# EAGLE design ESP-Easy FHEM Multi (EAGLE 8.4.3)
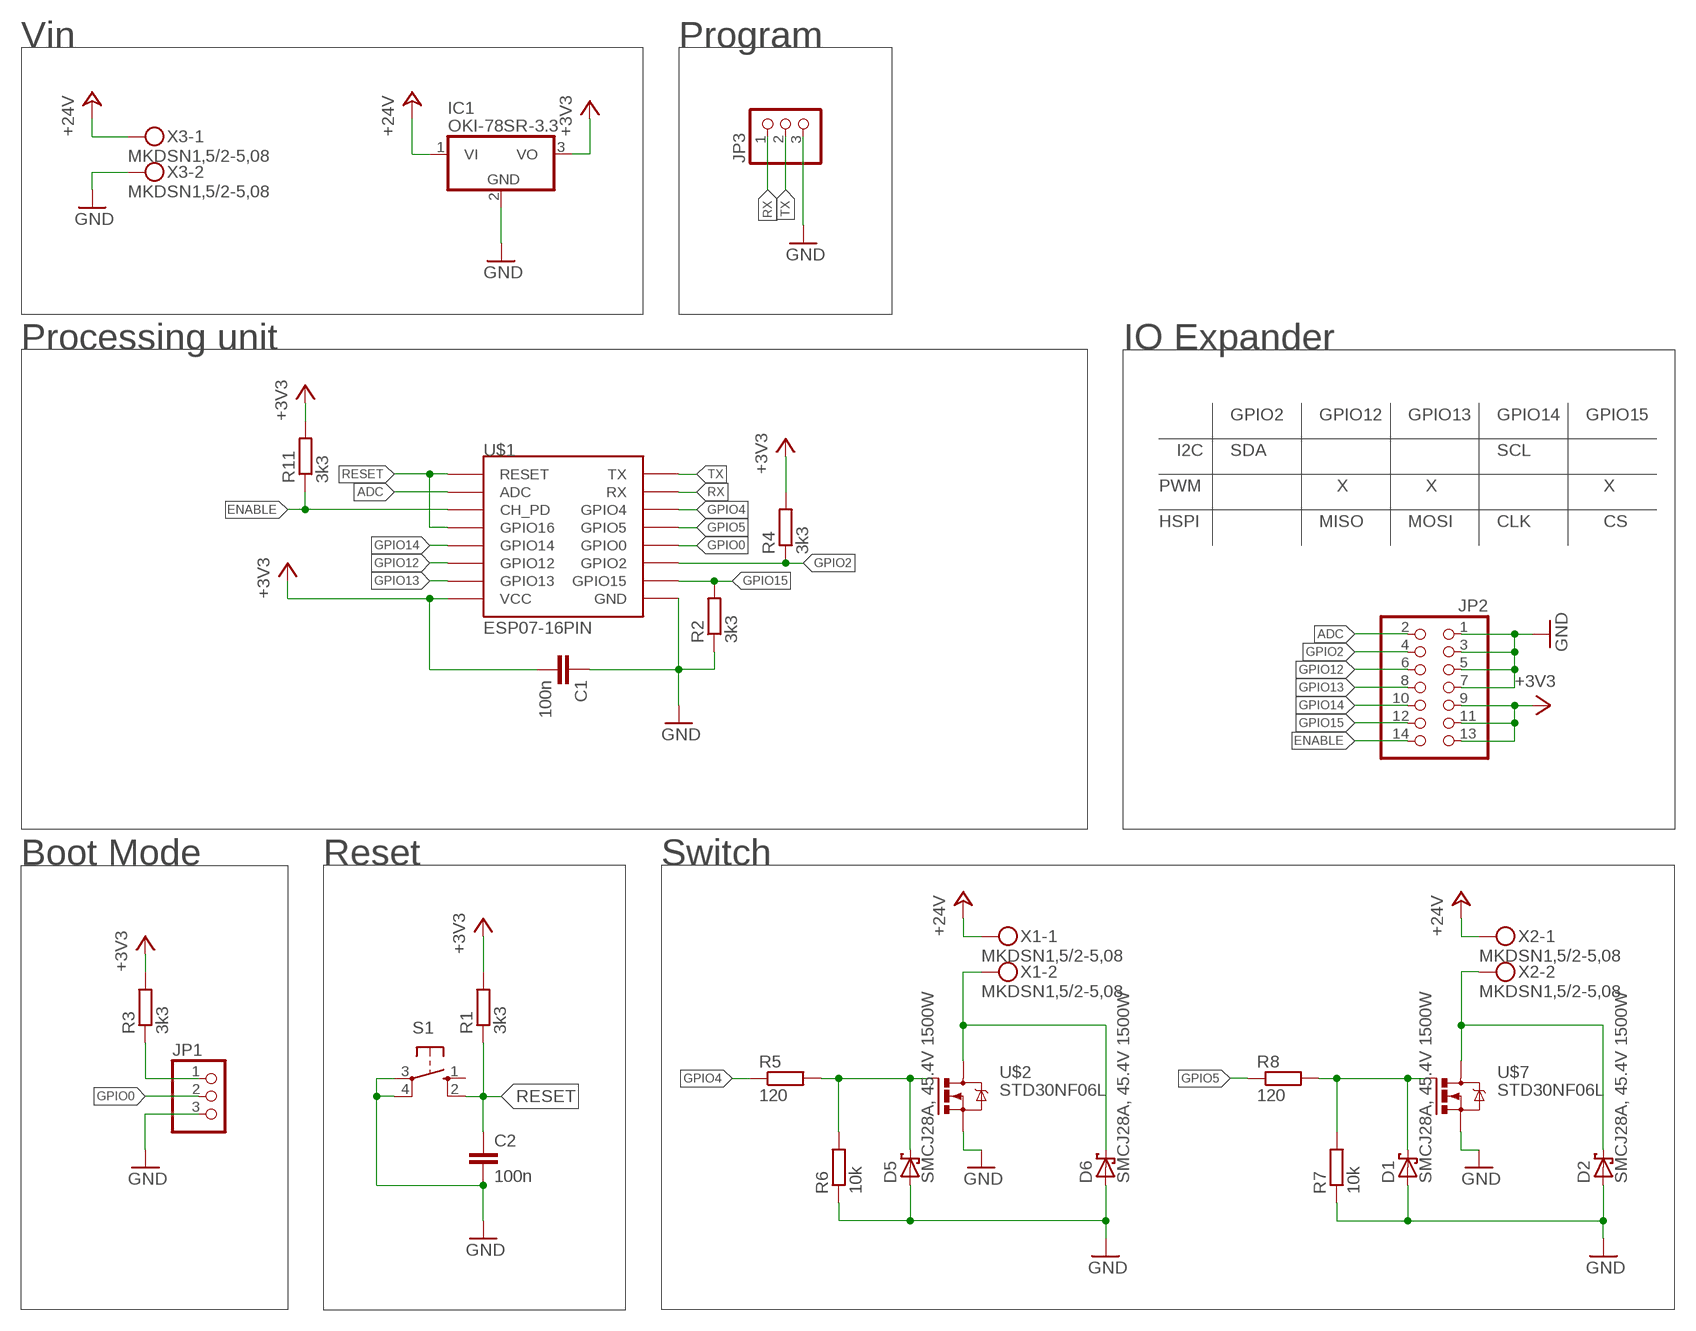
[diagram p0: schematic, sheet 1]

## Parts
C1  100n  C-EUC0603  [C0603]
C2  100n  C-EUC0603  [C0603]
D1  SMCJ28A, 45.4V 1500W  SCHOTTKY-DIODESMC  [SMC]
D2  SMCJ28A, 45.4V 1500W  SCHOTTKY-DIODESMC  [SMC]
D5  SMCJ28A, 45.4V 1500W  SCHOTTKY-DIODESMC  [SMC]
D6  SMCJ28A, 45.4V 1500W  SCHOTTKY-DIODESMC  [SMC]
IC1  OKI-78SR-3.3  7805TV  [TO220V]
JP1  PINHD-1X3  [1X03]
JP2  PINHD-2X7  [2X07]
JP3  PINHD-1X3  [1X03]
R1  3k3  R-EU_R0603  [R0603]
R2  3k3  R-EU_R0603  [R0603]
R3  3k3  R-EU_R0603  [R0603]
R4  3k3  R-EU_R0603  [R0603]
R5  120  R-EU_R0603  [R0603]
R6  10k  R-EU_R0603  [R0603]
R7  10k  R-EU_R0603  [R0603]
R8  120  R-EU_R0603  [R0603]
R11  3k3  R-EU_R0603  [R0603]
S1  10-XX  [B3F-10XX]
U$1  ESP07-16PIN  [ESP07-16PIN]
U$2  STD30NF06L  [D-PAK_TO252AA]
U$7  STD30NF06L  [D-PAK_TO252AA]
X1  MKDSN1,5/2-5,08  [MKDSN1,5/2-5,08]
X2  MKDSN1,5/2-5,08  [MKDSN1,5/2-5,08]
X3  MKDSN1,5/2-5,08  [MKDSN1,5/2-5,08]

## Nets
+3V3: C1.2 IC1.3(VO) JP2.9 JP2.11 JP2.13 R1.2 R3.2 R4.2 R11.2 U$1.VCC
+24V: IC1.1(VI) X1.1 X2.1 X3.1
ADC: JP2.2 U$1.ADC
ENABLE: JP2.14 R11.1 U$1.CH_PD
GND: C1.1 C2.2 D1.A D2.A D5.A D6.A IC1.2(GND) JP1.3 JP2.1 JP2.3 JP2.5 JP2.7 JP3.3 R2.1 R6.1 R7.1 S1.3(P) S1.4(P1) U$1.GND U$2.3(S) U$7.3(S) X3.2
GPIO0: JP1.2 U$1.GPIO0
GPIO2: JP2.4 R4.1 U$1.GPIO2
GPIO4: R5.1 U$1.GPIO4
GPIO5: R8.1 U$1.GPIO5
GPIO12: JP2.6 U$1.GPIO12
GPIO13: JP2.8 U$1.GPIO13
GPIO14: JP2.10 U$1.GPIO14
GPIO15: JP2.12 R2.2 U$1.GPIO15
N$1: D2.C U$7.4(D) X2.2
N$2: D1.C R7.2 R8.2 U$7.1(G)
N$3: D6.C U$2.4(D) X1.2
N$8: D5.C R5.2 R6.2 U$2.1(G)
N$13: JP1.1 R3.1
RESET: C2.1 R1.1 S1.2(S1) U$1.GPIO16 U$1.REST(RESET)
RX: JP3.1 U$1.RX
TX: JP3.2 U$1.TX
Unconnected: S1.1(S)

## Notes on the sheet
- Vin | Program
- Processing unit | IO Expander
- GPIO2 | GPIO12 | GPIO13 | GPIO14 | GPIO15
- I2C | SDA | SCL
- PWM | X | X | X
- HSPI | MISO | MOSI | CLK | CS
- Boot Mode | Reset | Switch

## Library data of the parts
C1 C2 = rcl:C-EU: CAPACITOR, European symbol
D1 D2 D5 D6 = diode:SCHOTTKY-DIODE: Schottky Diode
IC1 = linear:78*: Positive VOLTAGE REGULATOR Source: http://cache.national.com/ds/LM/LM78L05.pdf http://www.fairchildsemi.com/ds/LM/LM7805.pdf
JP1 JP3 = pinhead:PINHD-1X3: PIN HEADER
JP2 = pinhead:PINHD-2X7: PIN HEADER
R1-R5 R8 R11 = rcl:R-EU_: RESISTOR, European symbol
R6 R7 = resistor:R-EU_: RESISTOR, European symbol
S1 = switch-omron:10-XX: OMRON SWITCH; MPN: B3F-1000; OC_FARNELL: 176432; OC_NEWARK: 36M3542
U$1 = esp8266modules:ESP07-16PIN: ESP8266 Wifi module 07 - 16 pins; DIMENSIONS: 22.0 x 16.0 mm; PINS: 16; PITCH: 0.078" / 2 mm
U$2 U$7 = homelight:STD30NF06L
X1-X3 = con-phoenix-508:MKDSN1,5/2-5,08: MKDSN 1,5/ 2-5,08 Printklemme Nennstrom: 13,5 A Nennspannung: 250 V Rastermaß: 5,08 mm Polzahl: 2 Anschlussart: Schraubanschluss Montage: Löten Anschlussrichtung Leiter/Platine: 0 ° Artikelnummer: 1729128 Source: http://eshop.phoenixcontact.com .. 1729128.pdf

## Board
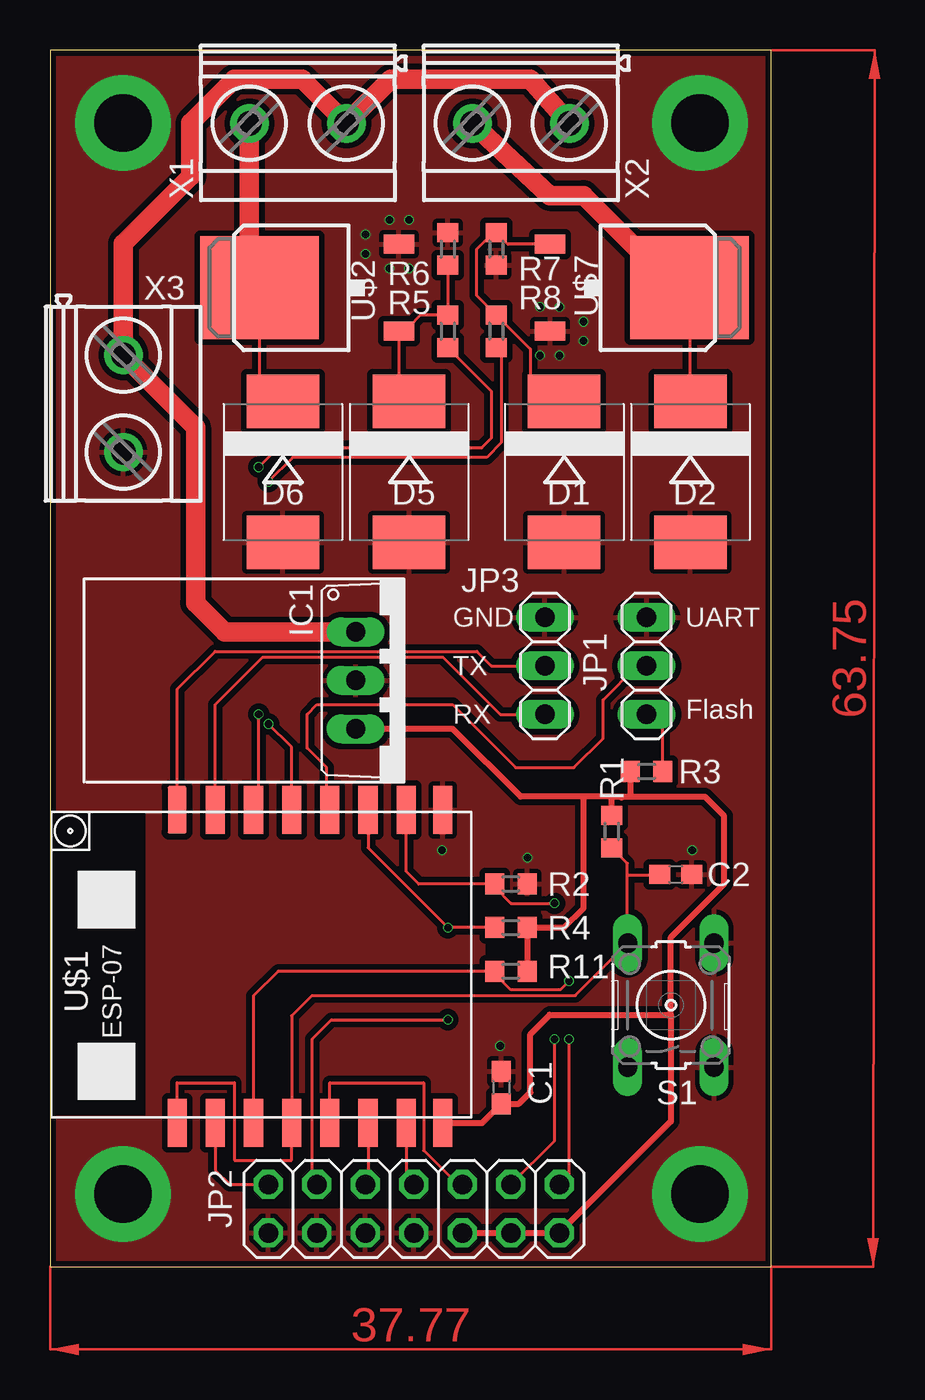
[diagram p1: board, top side]
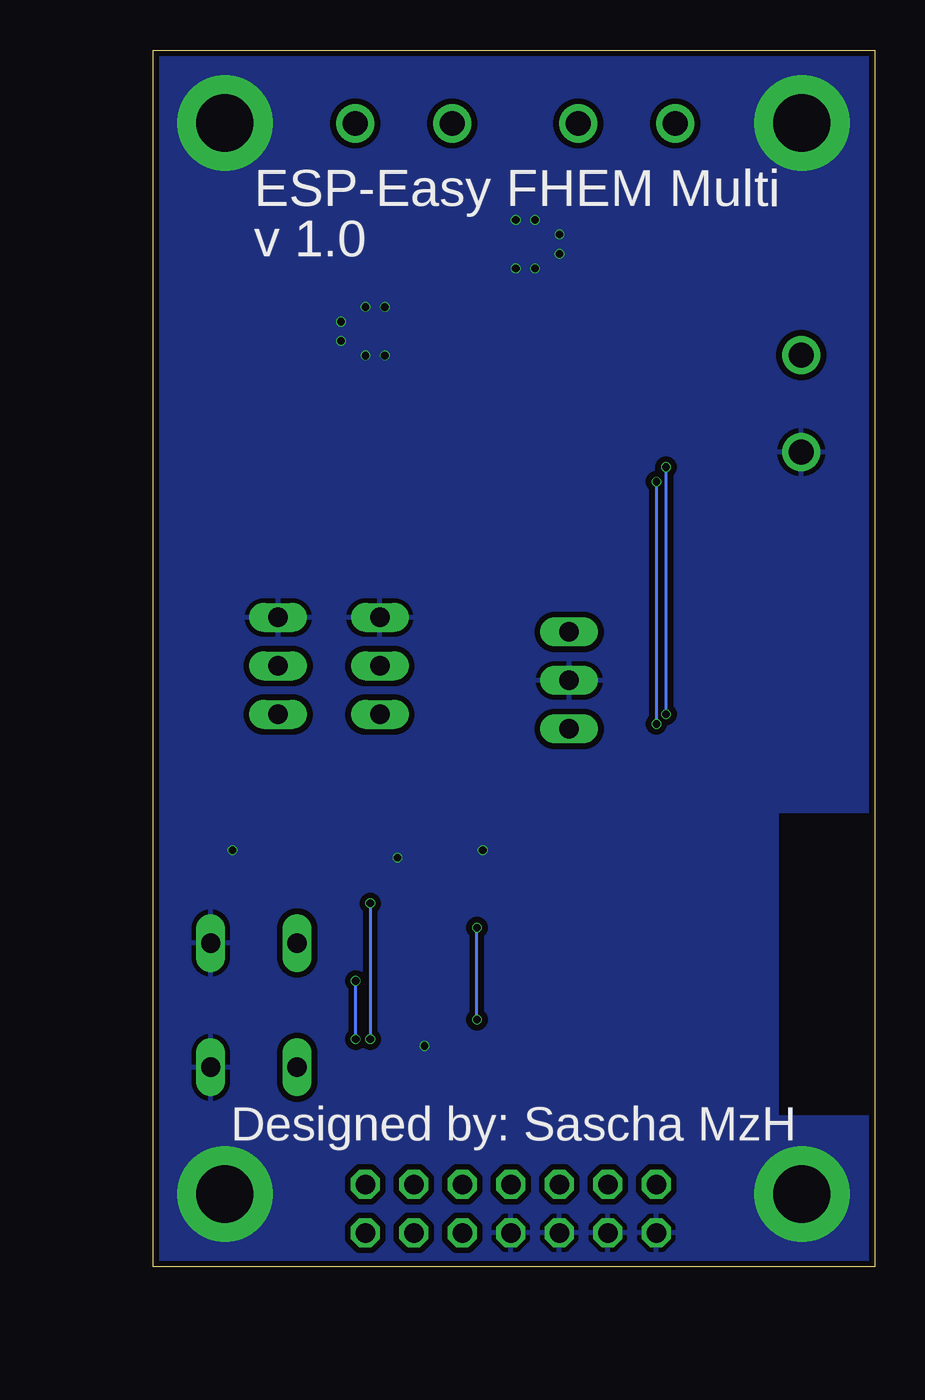
[diagram p2: board, bottom side, seen from below]

Size 37.77 x 63.74 mm. Coordinates in mm from the lower left corner, seen from the top.
Outline: 0,0 37.77,0 37.77,63.74 0,63.74 0,0
Copper layers (1*16): Top 0.035mm / dielectric 1.5mm / Bottom 0.035mm
Design rules "ESP-Easy FHEM Multi": minimum track width 0.1mm, minimum drill 0.2mm, track to track 0.15mm, track to pad 0.1mm, pad to pad 0.1mm, via to via 0.1mm, smd to smd 0mil, copper to edge 0.2mm, drill to drill 0.21mm, minimum pad ring 0.25mm, minimum via ring 0.05mm, stop-mask expansion 0.01mm, vias tented up to drill 32mil, thermal gap 10mil

### Footprints (pad centres in the part's own frame; a part is rotated, then mirrored left to right if it is on the bottom)
C0603 = smd 1.1 x 1: 1 -0.85,0; 2 0.85,0
SMC = smd 2.8 x 3.8: A 3.7,0; C -3.7,0
TO220V = drill 1.016 long: 1 -2.54,-2.54; 2 0,-2.54; 3 2.54,-2.54
1X03 = drill 1.016 long: 1 -2.54,0; 2 0,0; 3 2.54,0
2X07 = drill 1.016 octagon: 1 -7.62,-1.27; 2 -7.62,1.27; 3 -5.08,-1.27; 4 -5.08,1.27; 5 -2.54,-1.27; 6 -2.54,1.27; 7 0,-1.27; 8 0,1.27; 9 2.54,-1.27; 10 2.54,1.27; 11 5.08,-1.27; 12 5.08,1.27; 13 7.62,-1.27; 14 7.62,1.27
R0603 = smd 1 x 1.1: 1 -0.85,0; 2 0.85,0
B3F-10XX = drill 1.016 long: 1 -3.251,2.261; 2 3.251,2.261; 3 -3.251,-2.261; 4 3.251,-2.261
ESP07-16PIN = smd 2.5 x 1: ADC -8.2,3.8; CH_PD -8.2,1.8; GND 8.2,-8.105; GPIO0 8.2,-2.2; GPIO2 8.2,-4.2; GPIO4 8.2,1.8; GPIO5 8.2,-0.2; GPIO12 -8.2,-4.2; GPIO13 -8.2,-6.2; GPIO14 -8.2,-2.2; GPIO15 8.2,-6.2; GPIO16 -8.2,-0.2; REST -8.2,5.8; RX 8.2,3.8; TX 8.2,5.8; VCC -8.2,-8.105
D-PAK_TO252AA = smd 1 x 1.6: 1 -2.28,-4.8; 3 2.28,-4.8 | smd 5.4 x 6.2: 4 0,2.5
MKDSN1,5/2-5,08 = drill 1.3 pad 2: 1 -2.561,0.025; 2 2.519,0.025

### Placement (x,y rotation side)
C1  23.62,9.4 270 top
C2  32.77,20.57 0 top
D1  26.92,41.66 270 top
D2  33.53,41.66 270 top
D5  18.8,41.66 270 top
D6  12.19,41.66 270 top
IC1  18.54,30.73 270 top
JP1  31.24,31.5 90 top
JP2  19.05,3.05 0 top
JP3  25.91,31.5 90 top
R1  29.41,22.81 90 top
R2  24.13,20.07 180 top
R3  31.24,25.96 180 top
R4  24.13,17.78 0 top
R5  20.83,49.02 90 top
R6  20.83,53.34 270 top
R7  23.37,53.34 90 top
R8  23.37,49.02 90 top
R11  24.13,15.49 0 top
S1  32.51,13.72 90 top
U$1  12.45,15.75 90 top
U$2  13.46,51.31 90 top
U$7  30.99,51.31 270 top
X1  12.95,59.94 180 top
X2  24.64,59.94 180 top
X3  3.81,45.21 270 top

### Tracks (layer width: path | path; a pad name or v marks a point on that pad's centre or on a via)
+3V3
  Top 0.305: 30.48,24.64 34.29,24.64 35.31,23.62 35.31,20.07 32.51,17.27 32.51,13.21 | 29.97,24.64 30.48,24.64 | 29.36,24.64 29.97,24.64 | 29.36,24.64 27.94,24.64 | 25.15,17.78 R4.2 | 24.98,15.58 R11.2 R4.2 | JP2.9 JP2.11 JP2.13 32.51,7.62 32.51,13.21 | R4.2 26.92,17.78 27.94,18.8 27.94,24.64 | U$1.VCC 22.62,7.55 C1.2 24.55,8.55 25.15,9.14 25.15,12.19 26.16,13.21 32.51,13.21 | R3.2 30.39,24.73 30.48,24.64 | 27.94,24.64 24.64,24.64 21.08,28.19 IC1.3 | 29.92,24.59 29.97,24.64 | R1.2 29.41,24.59 29.36,24.64
+24V
  Top 1.016: X2.1 25.14,62.23 17.83,62.23 X1.1 13.2,62.23 9.65,62.23 7.37,59.94 7.37,57.15 3.83,53.62 X3.1 7.62,43.99 7.62,34.8 9.14,33.27 IC1.1
ADC
  Top 0.152: U$1.ADC 8.65,5.07 9.4,4.32 JP2.2
ENABLE  (via drill 0.4)
  Top 0.152: U$1.CH_PD 10.65,14.2 11.94,15.49 R11.1 23.28,15.38 24.13,14.53 26.72,14.53 v27.18,14.99 | JP2.14 27.18,4.83 v27.18,11.94
  Bottom 0.152: v27.18,11.94 v27.18,14.99
GND  (via drill 0.4, 3 pad 5)
  other vias: 3.81,59.94 34.04,59.94 34.04,3.81 3.81,3.81 17.78,54.86 18.8,54.86 18.8,52.32 17.78,52.32 16.51,53.09 16.51,54.1 25.65,50.29 26.67,50.29 27.94,49.53 27.94,48.51 26.67,47.75 25.65,47.75 20.52,21.84 24.99,21.44 33.63,21.84 23.57,11.58
  pour Bottom (isolate 0.305): 0,63.75 37.85,63.75 37.85,0 0,0 0,7.87 5.08,7.87 5.08,23.88 0,23.88
  pour Top (isolate 0.305): 0,63.75 37.85,63.75 37.85,0 0,0 0,7.87 5.08,7.87 5.08,23.88 0,23.88
  cutout Top: 10.16,5.69 10.16,3.15 27.94,3.15 27.94,5.59 27.84,5.69
GPIO0
  Top 0.152: U$1.GPIO0 14.48,24.12 14.48,26.16 13.46,27.18 13.46,28.96 13.97,29.46 21.08,29.46 24.38,26.16 27.43,26.16 28.96,27.69 28.96,29.72 30.73,31.5 JP1.2
GPIO2  (via drill 0.4)
  Top 0.152: U$1.GPIO2 16.65,21.96 v20.83,17.78 R4.1 | JP2.4 13.72,4.57 13.72,11.94 14.73,12.95 v20.83,12.95
  Bottom 0.152: v20.83,12.95 v20.83,17.78
GPIO4  (via drill 0.4)
  Top 0.152: R5.1 23.11,45.89 23.11,43.43 22.61,42.93 11.94,42.93 v10.92,41.91 | U$1.GPIO4 10.92,24.22 v10.92,28.96
  Bottom 0.152: v10.92,28.96 v10.92,41.91
GPIO5  (via drill 0.4)
  Top 0.152: R8.1 23.62,47.92 23.62,43.18 22.86,42.42 12.7,42.42 v11.43,41.15 | 12.65,24.69 U$1.GPIO5 12.65,27.23 v11.43,28.45
  Bottom 0.152: v11.43,41.15 v11.43,28.45
GPIO12
  Top 0.152: U$1.GPIO12 16.65,4.45 JP2.6
GPIO13
  Top 0.152: U$1.GPIO13 18.65,4.72 JP2.8
GPIO14
  Top 0.152: U$1.GPIO14 14.65,9.65 19.56,9.65 19.56,6.1 21.34,4.32 JP2.10
GPIO15  (via drill 0.4)
  Top 0.152: U$1.GPIO15 18.65,20.72 19.3,20.07 R2.2 23.28,19.9 24.13,19.05 v26.42,19.05 | JP2.12 26.42,6.6 v26.42,11.94
  Bottom 0.152: v26.42,19.05 v26.42,11.94
N$1
  Top 0.152: U$7.4 33.49,45.4 D2.C
  Top 1.016: U$7.4 33.53,51.31 33.53,51.05 33.02,51.05 27.94,56.13 26.16,56.13 X2.2
N$2
  Top 0.152: U$7.1 23.97,53.59 R7.2 23.2,54.19 22.35,53.34 22.35,50.89 R8.2 25.15,48.09 25.15,46.74 26.53,45.36 D1.C
N$3
  Top 0.152: U$2.4 10.96,46.59 D6.C
  Top 1.016: X1.2 10.44,51.84 U$2.4
N$4
  cutout Top (rank 2): 22.86,18.29 22.86,15.04 25.4,15.04 25.4,18.29
N$8
  Top 0.152: R6.2 R5.2 19.39,49.87 18.8,49.28 18.52,49.28 U$2.1 | U$2.1 | U$2.1 18.26,45.89 D5.C
N$13
  Top 0.152: R3.1 32.09,28.87 JP1.1
RESET
  Top 0.152: 31.92,20.49 C2.1 31.86,20.52 30.23,20.52 | U$1.REST 6.65,9.65 9.65,9.65 9.65,5.59 12.65,5.59 U$1.GPIO16 12.65,13.15 13.72,14.22 27.51,14.22 S1.2 30.23,16.99 30.23,20.52 | 30.23,20.52 30.23,21.15 R1.1
RX
  Top 0.152: U$1.RX 8.65,29.47 11.13,31.96 20.57,31.96 23.57,28.96 JP3.1
TX
  Top 0.152: U$1.TX 6.65,30.27 8.64,32.26 22.35,32.26 23.11,31.5 JP3.2
(copper drawn outside any net)
  shapes: Top area x2

### Text on the board
tPlace: GND | UART | TX | Flash | RX
bNames: ESP-Easy FHEM Multi | v 1.0 | Designed by: Sascha MzH